# EasyEDA Pro project ProPrj_Altruist.epro, board PCB TH
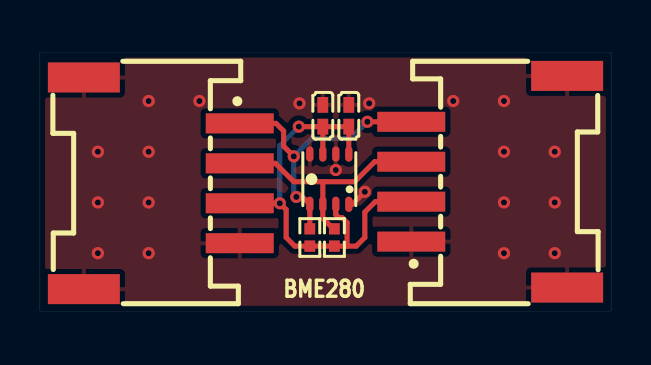
[diagram p5: board, top side]
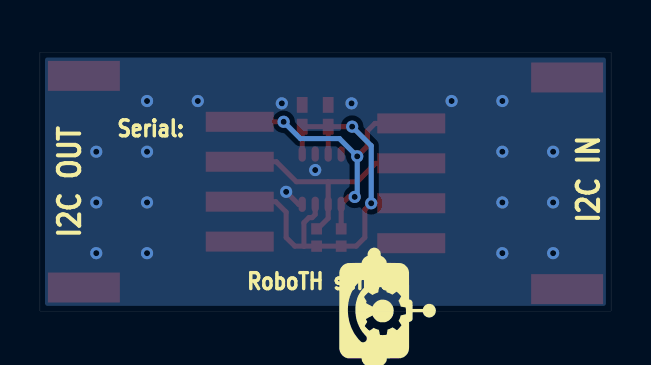
[diagram p6: board, bottom side, seen from below]

Outline 28.58 x 12.95 mm; copper layers: Top Layer, Bottom Layer. Coordinates in mm from the lower left corner of the outline.
Outline path: rectangle 0,12.95 28.58,0
Stack: Top Layer 0.035mm / Dielectric1 1.51mm FR4 er 4.5 / Bottom Layer 0.035mm

## Design rules (mm)
template: JLCPCB Capability(Two Layers Board)
spacing copperThickness1oz (default): track to track 0.102, other pairs 0.152 to 0.3
spacing copperThickness2oz: track to track 0.203, other pairs 0.152 to 0.3
track width copperThickness1oz (default): min 0.127, default 0.254, max 2.54
track width copperThickness2oz: min 0.203, default 0.254, max 2.54
differential pair differentialPair (default): width min 0.127, default 0.254, max 2.54; gap min 0.152, default 0.152
via viaSize (default): diameter min 0.5, default 0.61, max 10; hole min 0.3, default 0.305, max 6.3

## Placement (name value [footprint] x y rotation side)
C1  1uF  [C0402]  14.15 9.78 270 top
C2  100nF  [C0402]  15.45 9.78 90 top
R1  4.7kΩ  [R0402]  14.73 3.68 270 top
R2  4.7kΩ  [R0402]  13.5 3.68 270 top
SHT1  HY2.0-4P-C146060  [CONN-SMD_HY2.0-4P]  22.48 6.48 90 top
SHT2  HY2.0-4P-C146060  [CONN-SMD_HY2.0-4P]  6.1 6.4 270 top
U1  BME280  [LGA-8_BME280_BL]  14.48 6.6 270 top

## Footprints (pads in the part's own frame, mm; a bottom-side part is the same pattern mirrored in y, then rotated)
C0402
  rect 0.79x0.54 smd: 1(-0.545,0) 2(0.545,0)
CONN-SMD_HY2.0-4P
  rect 1x3.4 smd: 1(-3,3.9) 2(-1,3.9) 3(1,3.9) 4(3,3.9)
  rect 1.5x3.6 smd: 5(5.3,-3.9) 6(-5.3,-3.9)
LGA-8_BME280_BL
  oval 0.767x0.364 smd: 1(1.258,0.975) 2(1.258,0.325) 3(1.258,-0.325) 4(1.258,-0.975) 5(-1.258,-0.975) 6(-1.258,-0.325) 7(-1.258,0.325) 8(-1.258,0.975)
R0402
  rect 0.566x0.54 smd: 1(-0.433,0) 2(0.433,0)

## Nets
As in the schematic.

## Via types
v1: diameter 0.61, hole 0.305, Top Layer to Bottom Layer, 25 vias

## Routing (per net, layer and track width the routed paths; a pad name or vN(x,y) marks a point on that pad's centre or on a via; arc(x,y) is an arc through that point)
GND: length 1.1
  Top Layer w0.254: U1.1 15.63,5.35 v1(16.26,5.97)
  vias: v1(2.9,7.98) v1(2.9,5.44) v1(2.9,2.9) v1(5.44,10.52) v1(5.44,7.98) v1(5.44,5.44) v1(5.44,2.9) v1(7.98,10.52) v1(12.98,10.4) v1(14.8,7.06) v1(16.47,10.4) v1(20.68,10.52) v1(23.22,10.52) v1(23.22,7.98) v1(23.22,5.44) v1(23.22,2.9) v1(25.76,7.98) v1(25.76,5.44) v1(25.76,2.9)
VDD3V3: length 23.9
  Top Layer w0.254: U1.8 C2.1 C1.2 ; v1(12.95,9.23) C1.2 ; C1.2 U1.6 ; U1.2 14.8,4.83 14.96,4.68 15.12,4.68 15.37,4.43 15.37,3.26 15.36,3.25 ; 15.36,3.25 15.82,3.25 16.26,3.68 16.26,4.95 16.78,5.48 SHT1.2 ; 15.36,3.25 R1.2 R2.2 12.75,3.25 12.32,3.68 12.32,5.08 v1(12,5.4) SHT2.3
  Bottom Layer w0.254: v1(12.95,9.23) 12,8.28 v1(12,5.4)
SCL: length 14.6
  Top Layer w0.254: SHT2.1 11.81,9.4 12.19,9.02 12.19,8.25 v1(12.7,7.75) ; 16.38,9.52 16.43,9.48 SHT1.4 ; R2.1 U1.4 13.13,5.71 v1(12.83,5.71)
  Bottom Layer w0.254: v1(12.83,5.71) 12.7,5.84 v1(12.7,7.75) 13.59,8.64 15.54,8.64 v1(16.38,9.48)
SDA: length 12
  Top Layer w0.254: 14.16,6.48 12.7,6.48 11.78,7.4 SHT2.2 ; 14.16,6.48 15.75,6.48 16.75,7.48 SHT1.3 ; 14.16,6.48 14.15,6.47 U1.3 14.15,4.64 14.68,4.12 R1.1

## Copper pours and planes (outline as drawn; the poured copper is in the pictures)
GND on Top Layer: -0.63,13.46 29.46,13.46 29.46,-0.89 -0.63,-0.89
GND on Bottom Layer: -0.39,13.46 28.96,13.46 28.96,-0.51 -0.39,-0.51

## Text on the board
Bottom Silkscreen Layer: RoboTH sensor | Serial: | I2C IN | I2C OUT
Top Silkscreen Layer: BME280
